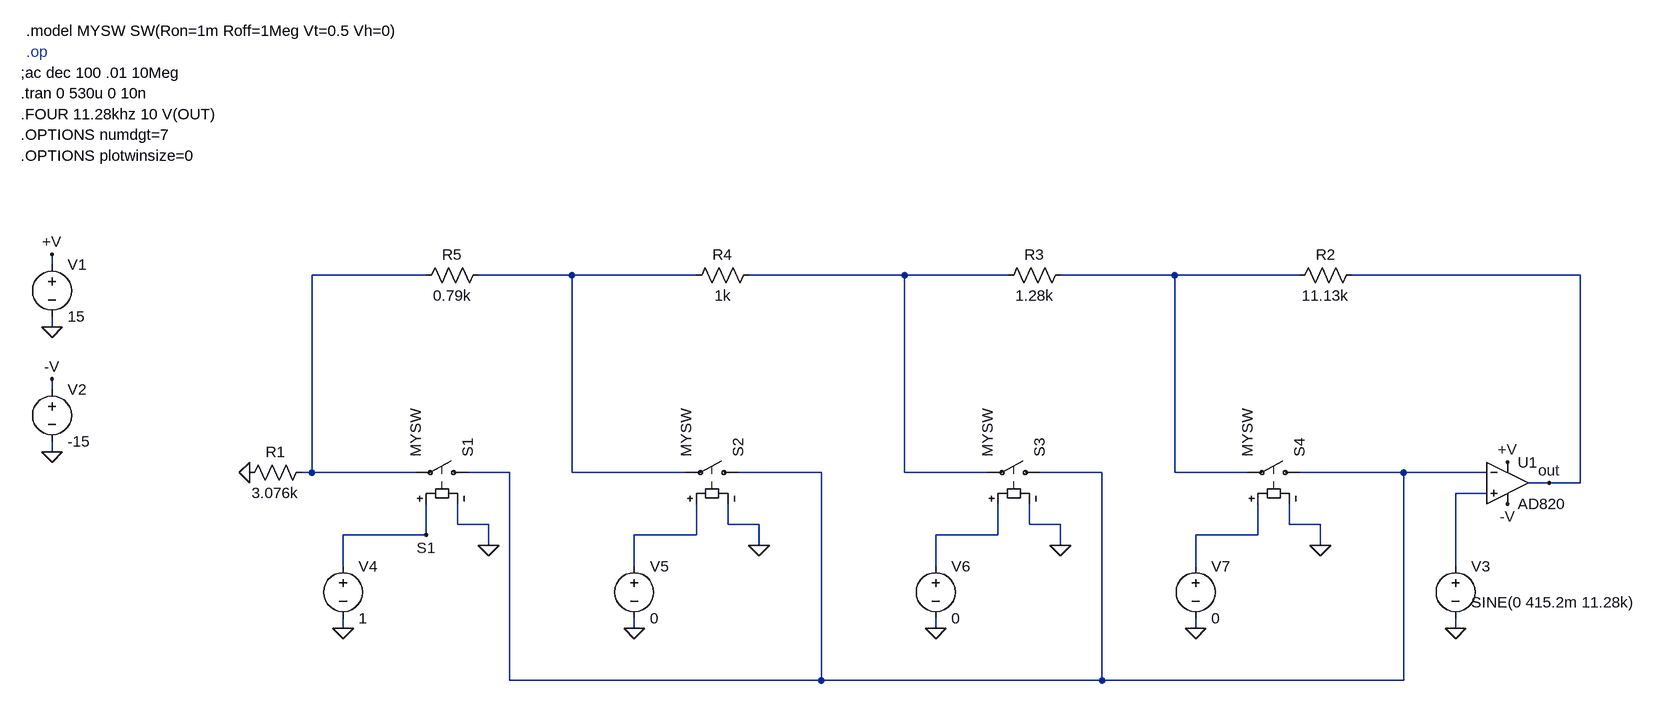
[diagram p0: schematic Etaj3 SW ideale.asc]
Etaj3 SW ideale.asc, the LTspice schematic file:
Version 4
SHEET 1 2476 1380
WIRE 16 448 16 432
WIRE 592 464 416 464
WIRE 816 464 672 464
WIRE 1008 464 816 464
WIRE 1328 464 1088 464
WIRE 1488 464 1328 464
WIRE 1744 464 1568 464
WIRE 1936 464 1744 464
WIRE 2368 464 2016 464
WIRE 16 544 16 528
WIRE 16 640 16 624
WIRE 16 736 16 720
WIRE 416 768 416 464
WIRE 416 768 400 768
WIRE 576 768 416 768
WIRE 720 768 656 768
WIRE 816 768 816 464
WIRE 992 768 816 768
WIRE 1200 768 1072 768
WIRE 1328 768 1328 464
WIRE 1456 768 1328 768
WIRE 1632 768 1536 768
WIRE 1744 768 1744 464
WIRE 1856 768 1744 768
WIRE 2096 768 1936 768
WIRE 2224 768 2096 768
WIRE 2320 784 2288 784
WIRE 2368 784 2368 464
WIRE 2368 784 2320 784
WIRE 2224 800 2176 800
WIRE 640 848 640 816
WIRE 688 848 640 848
WIRE 1056 848 1056 816
WIRE 1104 848 1056 848
WIRE 1520 848 1520 816
WIRE 1568 848 1520 848
WIRE 1920 848 1920 816
WIRE 1968 848 1920 848
WIRE 592 864 592 816
WIRE 592 864 464 864
WIRE 1008 864 1008 816
WIRE 1008 864 912 864
WIRE 1472 864 1472 816
WIRE 1472 864 1376 864
WIRE 1872 864 1872 816
WIRE 1872 864 1776 864
WIRE 688 880 688 848
WIRE 1104 880 1104 848
WIRE 1568 880 1568 848
WIRE 1968 880 1968 848
WIRE 464 912 464 864
WIRE 912 912 912 864
WIRE 1376 912 1376 864
WIRE 1776 912 1776 864
WIRE 2176 912 2176 800
WIRE 464 1008 464 992
WIRE 912 1008 912 992
WIRE 1376 1008 1376 992
WIRE 1776 1008 1776 992
WIRE 2176 1008 2176 992
WIRE 720 1088 720 768
WIRE 1200 1088 1200 768
WIRE 1200 1088 720 1088
WIRE 1632 1088 1632 768
WIRE 1632 1088 1200 1088
WIRE 2096 1088 2096 768
WIRE 2096 1088 1632 1088
FLAG 16 736 0
FLAG 16 544 0
FLAG 16 432 +V
FLAG 16 624 -V
FLAG 320 768 0
FLAG 2256 752 +V
FLAG 2256 816 -V
FLAG 2176 1008 0
FLAG 2320 784 out
FLAG 592 864 S1
FLAG 688 880 0
FLAG 1104 880 0
FLAG 1568 880 0
FLAG 1968 880 0
FLAG 1776 1008 0
FLAG 1376 1008 0
FLAG 464 1008 0
FLAG 912 1008 0
SYMBOL voltage 16 432 R0
WINDOW 123 0 0 Left 0
WINDOW 39 0 0 Left 0
SYMATTR InstName V1
SYMATTR Value 15
SYMBOL voltage 16 624 R0
WINDOW 123 0 0 Left 0
WINDOW 39 0 0 Left 0
SYMATTR InstName V2
SYMATTR Value -15
SYMBOL OpAmps\\AD820 2256 720 R0
SYMATTR InstName U1
SYMBOL res 416 752 R90
WINDOW 0 0 56 VBottom 2
WINDOW 3 32 56 VTop 2
SYMATTR InstName R1
SYMATTR Value 3.076k
SYMBOL voltage 2176 896 R0
WINDOW 123 24 44 Left 2
WINDOW 39 0 0 Left 0
WINDOW 3 24 72 Left 2
SYMATTR Value SINE(0 415.2m 11.28k)
SYMATTR InstName V3
SYMBOL res 2032 448 R90
WINDOW 0 0 56 VBottom 2
WINDOW 3 32 56 VTop 2
SYMATTR InstName R2
SYMATTR Value 11.13k
SYMBOL res 1584 448 R90
WINDOW 0 0 56 VBottom 2
WINDOW 3 32 56 VTop 2
SYMATTR InstName R3
SYMATTR Value 1.28k
SYMBOL res 1104 448 R90
WINDOW 0 0 56 VBottom 2
WINDOW 3 32 56 VTop 2
SYMATTR InstName R4
SYMATTR Value 1k
SYMBOL res 688 448 R90
WINDOW 0 0 56 VBottom 2
WINDOW 3 32 56 VTop 2
SYMATTR InstName R5
SYMATTR Value 0.79k
SYMBOL sw 672 768 M270
SYMATTR InstName S1
SYMATTR Value MYSW
SYMBOL sw 1088 768 M270
SYMATTR InstName S2
SYMATTR Value MYSW
SYMBOL sw 1552 768 M270
SYMATTR InstName S3
SYMATTR Value MYSW
SYMBOL sw 1952 768 M270
SYMATTR InstName S4
SYMATTR Value MYSW
SYMBOL voltage 464 896 R0
WINDOW 123 0 0 Left 0
WINDOW 39 0 0 Left 0
SYMATTR InstName V4
SYMATTR Value 1
SYMBOL voltage 912 896 R0
WINDOW 123 0 0 Left 0
WINDOW 39 0 0 Left 0
SYMATTR InstName V5
SYMATTR Value 0
SYMBOL voltage 1376 896 R0
WINDOW 123 0 0 Left 0
WINDOW 39 0 0 Left 0
SYMATTR InstName V6
SYMATTR Value 0
SYMBOL voltage 1776 896 R0
WINDOW 123 0 0 Left 0
WINDOW 39 0 0 Left 0
SYMATTR InstName V7
SYMATTR Value 0
TEXT -32 184 Left 2 !.tran 0 530u 0 10n
TEXT -32 152 Left 2 !;ac dec 100 .01 10Meg
TEXT -32 216 Left 2 !.FOUR 11.28khz 10 V(OUT)
TEXT -32 248 Left 2 !.OPTIONS numdgt=7
TEXT -32 280 Left 2 !.OPTIONS plotwinsize=0
TEXT -24 120 Left 2 ;.op
TEXT -24 88 Left 2 !.model MYSW SW(Ron=1m Roff=1Meg Vt=0.5 Vh=0)

The netlist it stands for:
* Etaj3 SW ideale.asc
V1 +V 0 15
V2 -V 0 -15
XU1 N006 N005 +V -V out AD820  ; pins In+ In- V+ V- OUT
R1 N001 0 3.076k
V3 N006 0 SINE(0 415.2m 11.28k)
R2 out N004 11.13k
R3 N004 N003 1.28k
R4 N003 N002 1k
R5 N002 N001 0.79k
S1 N005 N001 S1 0 MYSW
S2 N005 N002 N007 0 MYSW
S3 N005 N003 N008 0 MYSW
S4 N005 N004 N009 0 MYSW
V4 S1 0 1
V5 N007 0 0
V6 N008 0 0
V7 N009 0 0
.tran 0 530u 0 10n
;ac dec 100 .01 10Meg
.FOUR 11.28khz 10 V(OUT)
.OPTIONS numdgt=7
.OPTIONS plotwinsize=0
* .op
.model MYSW SW(Ron=1m Roff=1Meg Vt=0.5 Vh=0)
.backanno
.end